# EAGLE schematic boneclamp (EAGLE 6.4)

## Sheet 1 of 3
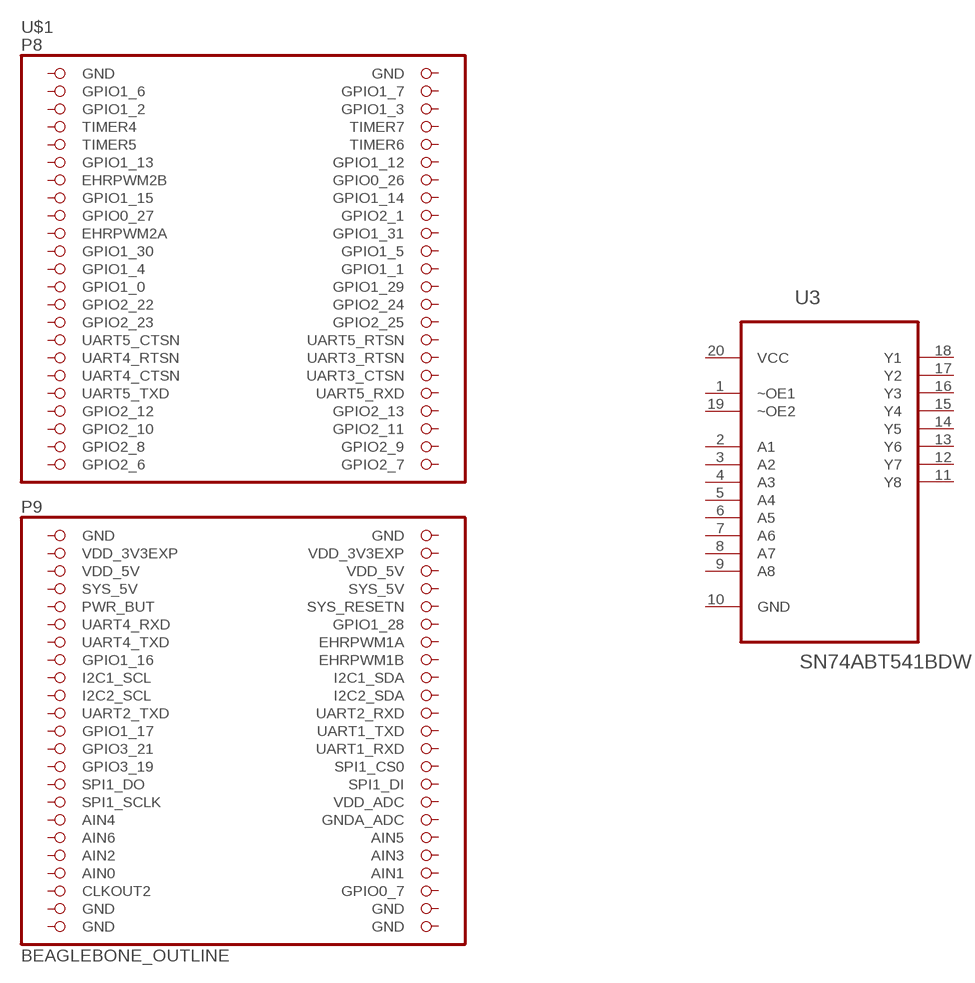
[diagram p0: schematic, sheet 1]

### Parts
U3  SN74ABT541BDW  [SOIC127P1030X265-20N]
U$1  BEAGLEBONE_OUTLINE  [BEAGLEBONE_SHIELD]
Unconnected: U3.1(~OE1) U3.2(A1) U3.3(A2) U3.4(A3) U3.5(A4) U3.6(A5) U3.7(A6) U3.8(A7) U3.9(A8) U3.10(GND) U3.11(Y8) U3.12(Y7) U3.13(Y6) U3.14(Y5) U3.15(Y4) U3.16(Y3) U3.17(Y2) U3.18(Y1) U3.19(~OE2) U$1.3(GPIO1_6) U$1.4(GPIO1_7) U$1.5(GPIO1_2) U$1.6(GPIO1_3) U$1.7(TIMER4) U$1.8(TIMER7) U$1.9(TIMER5) U$1.10(TIMER6) U$1.11(GPIO1_13) U$1.12(GPIO1_12) U$1.13(EHRPWM2B) U$1.14(GPIO0_26) U$1.15(GPIO1_15) U$1.16(GPIO1_14) U$1.17(GPIO0_27) U$1.18(GPIO2_1) U$1.19(EHRPWM2A) U$1.20(GPIO1_31) U$1.21(GPIO1_30) U$1.22(GPIO1_5) U$1.23(GPIO1_4) U$1.24(GPIO1_1) U$1.25(GPIO1_0) U$1.26(GPIO1_29) U$1.27(GPIO2_22) U$1.28(GPIO2_24) U$1.29(GPIO2_23) U$1.30(GPIO2_25) U$1.31(UART5_CTSN) U$1.32(UART5_RTSN) U$1.33(UART4_RTSN) U$1.34(UART3_RTSN) U$1.35(UART4_CTSN) U$1.36(UART3_CTSN) U$1.37(UART5_TXD) U$1.38(UART5_RXD) U$1.39(GPIO2_12) U$1.40(GPIO2_13) U$1.41(GPIO2_10) U$1.42(GPIO2_11) U$1.43(GPIO2_8) U$1.44(GPIO2_9) U$1.45(GPIO2_6) U$1.46(GPIO2_7) U$1.54(SYS_5V) U$1.55(PWR_BUT) U$1.56(SYS_RESETN) U$1.57(UART4_RXD) U$1.58(GPIO1_28) U$1.59(UART4_TXD) U$1.60(EHRPWM1A) U$1.61(GPIO1_16) U$1.62(EHRPWM1B) U$1.63(I2C1_SCL) U$1.64(I2C1_SDA) U$1.65(I2C2_SCL) U$1.66(I2C2_SDA) U$1.67(UART2_TXD) U$1.68(UART2_RXD) U$1.69(GPIO1_17) U$1.70(UART1_TXD) U$1.71(GPIO3_21) U$1.72(UART1_RXD) U$1.73(GPIO3_19) U$1.74(SPI1_CS0) U$1.75(SPI1_DO) U$1.76(SPI1_DI) U$1.77(SPI1_SCLK) U$1.78(VDD_ADC) U$1.79(AIN4) U$1.80(GNDA_ADC) U$1.81(AIN6) U$1.82(AIN5) U$1.83(AIN2) U$1.84(AIN3) U$1.86(AIN1) U$1.87(CLKOUT2) U$1.88(GPIO0_7)

## Sheet 2 of 3
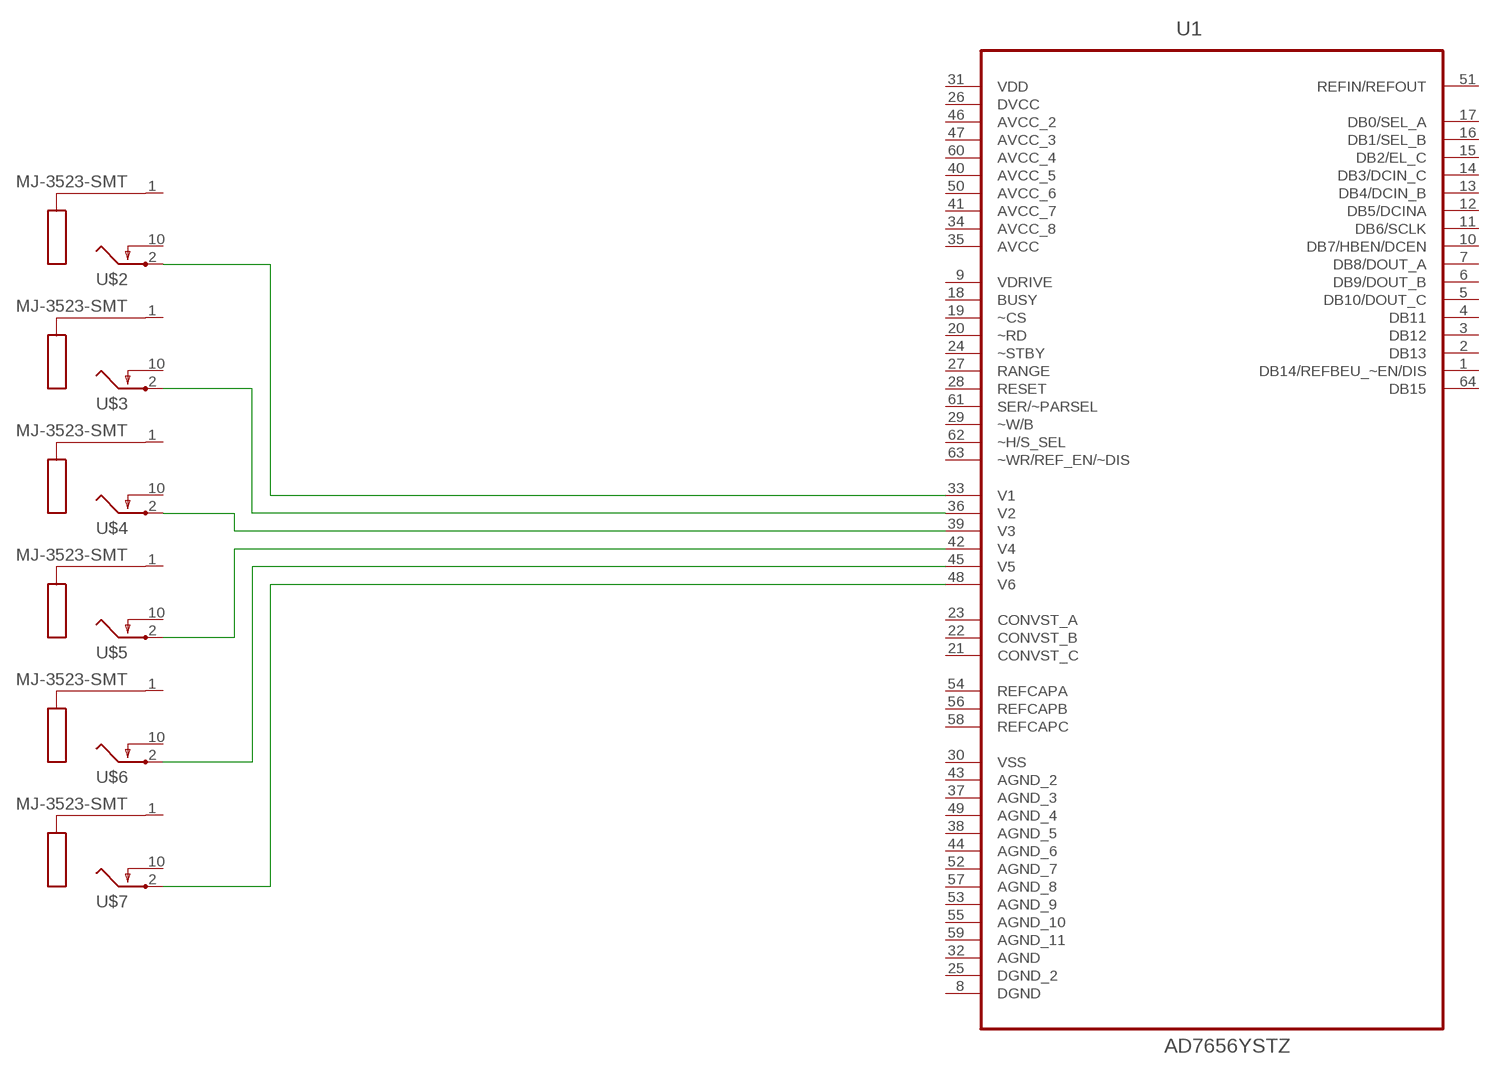
[diagram p1: schematic, sheet 2]

### Parts
U1  AD7656YSTZ  [QFP50P1200X1200X160-64N]
U$2  MJ-3523-SMT  [MJ-3523-SMT]
U$3  MJ-3523-SMT  [MJ-3523-SMT]
U$4  MJ-3523-SMT  [MJ-3523-SMT]
U$5  MJ-3523-SMT  [MJ-3523-SMT]
U$6  MJ-3523-SMT  [MJ-3523-SMT]
U$7  MJ-3523-SMT  [MJ-3523-SMT]

### Nets
N$1: U1.45(V5) U$6.2(TIP)
N$2: U1.48(V6) U$7.2(TIP)
N$3: U1.42(V4) U$5.2(TIP)
N$4: U1.39(V3) U$4.2(TIP)
N$5: U1.36(V2) U$3.2(TIP)
N$6: U1.33(V1) U$2.2(TIP)
Unconnected: U1.1(DB14/REFBEU_~EN/DIS) U1.2(DB13) U1.3(DB12) U1.4(DB11) U1.5(DB10/DOUT_C) U1.6(DB9/DOUT_B) U1.7(DB8/DOUT_A) U1.8(DGND) U1.9(VDRIVE) U1.10(DB7/HBEN/DCEN) U1.11(DB6/SCLK) U1.12(DB5/DCINA) U1.13(DB4/DCIN_B) U1.14(DB3/DCIN_C) U1.15(DB2/EL_C) U1.16(DB1/SEL_B) U1.17(DB0/SEL_A) U1.18(BUSY) U1.19(~CS) U1.20(~RD) U1.21(CONVST_C) U1.22(CONVST_B) U1.23(CONVST_A) U1.24(~STBY) U1.25(DGND_2) U1.27(RANGE) U1.28(RESET) U1.29(~W/B) U1.32(AGND) U1.37(AGND_3) U1.38(AGND_5) U1.43(AGND_2) U1.44(AGND_6) U1.49(AGND_4) U1.51(REFIN/REFOUT) U1.52(AGND_7) U1.53(AGND_9) U1.54(REFCAPA) U1.55(AGND_10) U1.56(REFCAPB) U1.57(AGND_8) U1.58(REFCAPC) U1.59(AGND_11) U1.61(SER/~PARSEL) U1.62(~H/S_SEL) U1.63(~WR/REF_EN/~DIS) U1.64(DB15) U$2.1(EARTH) U$2.10(TSHUNT) U$3.1(EARTH) U$3.10(TSHUNT) U$4.1(EARTH) U$4.10(TSHUNT) U$5.1(EARTH) U$5.10(TSHUNT) U$6.1(EARTH) U$6.10(TSHUNT) U$7.1(EARTH) U$7.10(TSHUNT)

## Sheet 3 of 3
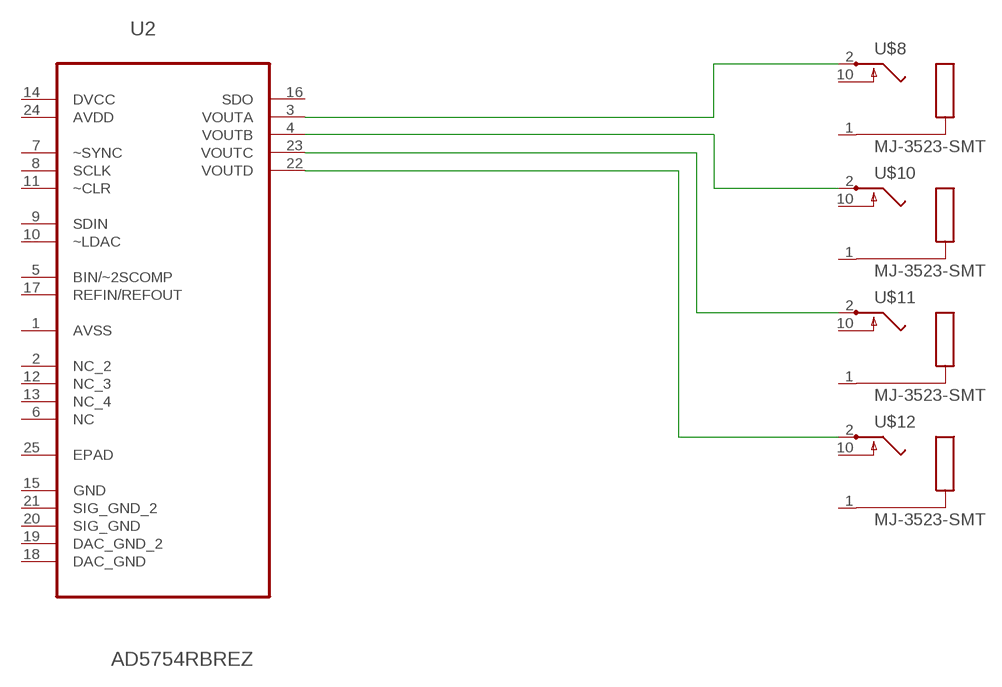
[diagram p2: schematic, sheet 3]

### Parts
U2  AD5754RBREZ  [SOP65P640X120-25N]
U$8  MJ-3523-SMT  [MJ-3523-SMT]
U$10  MJ-3523-SMT  [MJ-3523-SMT]
U$11  MJ-3523-SMT  [MJ-3523-SMT]
U$12  MJ-3523-SMT  [MJ-3523-SMT]

### Nets
N$7: U2.3(VOUTA) U$8.2(TIP)
N$8: U2.4(VOUTB) U$10.2(TIP)
N$9: U2.23(VOUTC) U$11.2(TIP)
N$11: U2.22(VOUTD) U$12.2(TIP)
Unconnected: U2.2(NC_2) U2.5(BIN/~2SCOMP) U2.6(NC) U2.7(~SYNC) U2.8(SCLK) U2.9(SDIN) U2.10(~LDAC) U2.11(~CLR) U2.12(NC_3) U2.13(NC_4) U2.15(GND) U2.16(SDO) U2.17(REFIN/REFOUT) U2.18(DAC_GND) U2.19(DAC_GND_2) U2.20(SIG_GND) U2.21(SIG_GND_2) U$8.1(EARTH) U$8.10(TSHUNT) U$10.1(EARTH) U$10.10(TSHUNT) U$11.1(EARTH) U$11.10(TSHUNT) U$12.1(EARTH) U$12.10(TSHUNT)

## Power pins joined to a net without a drawn wire
AIN0: U$1.85(AIN0)
AVCC: U1.35(AVCC)
AVCC_2: U1.46(AVCC_2)
AVCC_3: U1.47(AVCC_3)
AVCC_4: U1.60(AVCC_4)
AVCC_5: U1.40(AVCC_5)
AVCC_6: U1.50(AVCC_6)
AVCC_7: U1.41(AVCC_7)
AVCC_8: U1.34(AVCC_8)
AVDD: U2.24(AVDD)
AVSS: U2.1(AVSS)
DVCC: U1.26(DVCC) U2.14(DVCC)
EPAD: U2.25(EPAD)
GND: U$1.1(GND) U$1.2(GND) U$1.47(GND) U$1.48(GND) U$1.89(GND) U$1.90(GND) U$1.91(GND) U$1.92(GND)
SYS_5V: U$1.53(SYS_5V)
VCC: U3.20(VCC)
VDD: U1.31(VDD)
VDD_3V3EXP: U$1.49(VDD_3V3EXP) U$1.50(VDD_3V3EXP)
VDD_5V: U$1.51(VDD_5V) U$1.52(VDD_5V)
VSS: U1.30(VSS)

## Library data of the parts
U1 = analog-devices-01:AD7656YSTZ: ADC; MPN: AD7656YSTZ; OC_FARNELL: 1274233; OC_NEWARK: 19M0880; PACKAGE: LQFP-64; SUPPLIER: ANALOG DEVICES
U2 = analog-devices-01:AD5754RBREZ: DAC; MPN: AD5754RBREZ; OC_FARNELL: 1786050; OC_NEWARK: 51P3755; PACKAGE: TSSOP-24; SUPPLIER: Analog Devices
U3 = ti-extended:SN74ABT541BDW: OCTAL BUFFERS/DRIVERS; MPN: SN74ABT541BDW; OC_FARNELL: 9590170; OC_NEWARK: 85F222; PACKAGE: SOIC-20; SUPPLIER: Texas Instruments
U$1 = adafruit:BEAGLEBONE_OUTLINE: Should match A3 pinout - but not completely tested
U$2-U$8 U$10-U$12 = con-cuistack:MJ-3523-SMT